# EAGLE design DisplayArrayPlus (EAGLE 9.6.2)

## Sheet 1 of 2
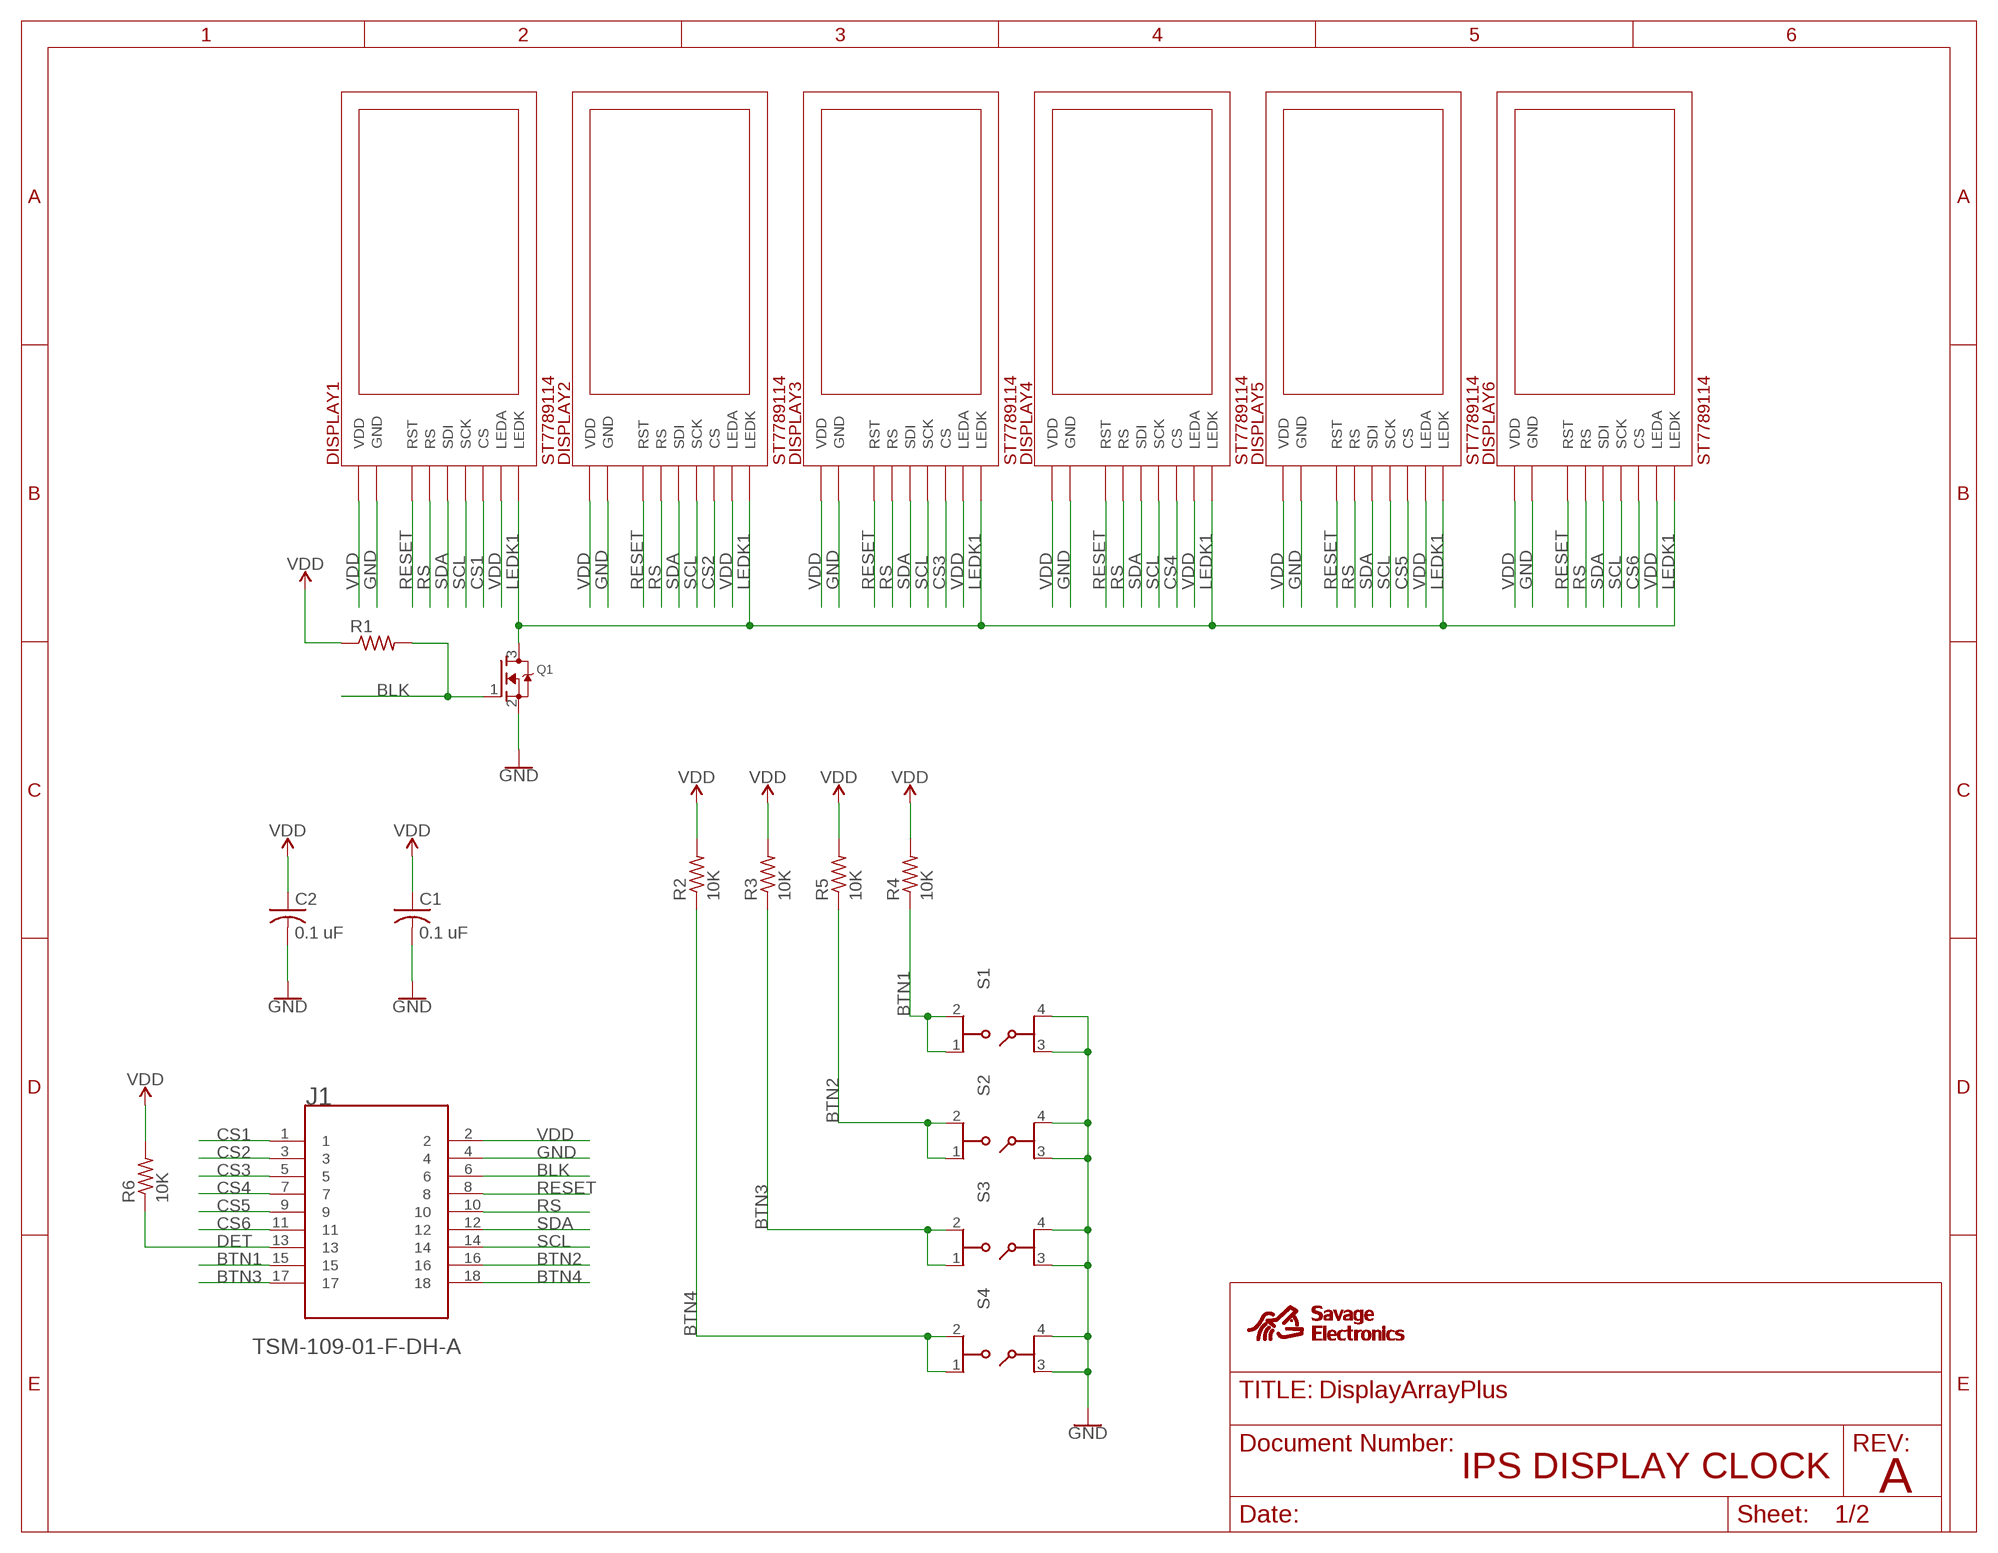
[diagram p0: schematic, sheet 1]

### Parts
C1  0.1 uF  C-USC0603  [C0603]
C2  0.1 uF  C-USC0603  [C0603]
DISPLAY1  ST7789114  [IPSLCD114]
DISPLAY2  ST7789114  [IPSLCD114]
DISPLAY3  ST7789114  [IPSLCD114]
DISPLAY4  ST7789114  [IPSLCD114]
DISPLAY5  ST7789114  [IPSLCD114]
DISPLAY6  ST7789114  [IPSLCD114]
J1  TSM-109-01-F-DH-A  SAMTEC-TSM-109-02-X-DH-AJ  [SAMTEC-TSM-109-02-X-DH-A]
Q1  MOSFET-NREFLOW  [SOT23]
R1  R-US_R0805  [R0805]
R2  10K  R-US_R0805  [R0805]
R3  10K  R-US_R0805  [R0805]
R4  10K  R-US_R0805  [R0805]
R5  10K  R-US_R0805  [R0805]
R6  10K  R-US_R0805  [R0805]
S1  434123025826  [434123025826]
S2  434123025826  [434123025826]
S3  434123025826  [434123025826]
S4  434123025826  [434123025826]
U$3  SE_SMALL_SILK  [SE_SMALL_SILK]

### Nets
BLK: J1.6 Q1.1(G) R1.2
BTN1: J1.15 R4.1 S1.1 S1.2
BTN2: J1.16 R5.1 S2.1 S2.2
BTN3: J1.17 R3.1 S3.1 S3.2
BTN4: J1.18 R2.1 S4.1 S4.2
CS1: DISPLAY1.7(CS) J1.1
CS2: DISPLAY2.7(CS) J1.3
CS3: DISPLAY3.7(CS) J1.5
CS4: DISPLAY4.7(CS) J1.7
CS5: DISPLAY5.7(CS) J1.9
CS6: DISPLAY6.7(CS) J1.11
DET: J1.13 R6.1
GND: C1.2 C2.2 DISPLAY1.8(GND) DISPLAY1.13(GND) DISPLAY2.8(GND) DISPLAY2.13(GND) DISPLAY3.8(GND) DISPLAY3.13(GND) DISPLAY4.8(GND) DISPLAY4.13(GND) DISPLAY5.8(GND) DISPLAY5.13(GND) DISPLAY6.8(GND) DISPLAY6.13(GND) J1.4 Q1.2(S) S1.3 S1.4 S2.3 S2.4 S3.3 S3.4 S4.3 S4.4
LEDK1: DISPLAY1.11(LEDK) DISPLAY2.11(LEDK) DISPLAY3.11(LEDK) DISPLAY4.11(LEDK) DISPLAY5.11(LEDK) DISPLAY6.11(LEDK) Q1.3(D)
RESET: DISPLAY1.6(RST) DISPLAY2.6(RST) DISPLAY3.6(RST) DISPLAY4.6(RST) DISPLAY5.6(RST) DISPLAY6.6(RST) J1.8
RS: DISPLAY1.5(RS) DISPLAY2.5(RS) DISPLAY3.5(RS) DISPLAY4.5(RS) DISPLAY5.5(RS) DISPLAY6.5(RS) J1.10
SCL: DISPLAY1.4(SCK) DISPLAY2.4(SCK) DISPLAY3.4(SCK) DISPLAY4.4(SCK) DISPLAY5.4(SCK) DISPLAY6.4(SCK) J1.14
SDA: DISPLAY1.3(SDI) DISPLAY2.3(SDI) DISPLAY3.3(SDI) DISPLAY4.3(SDI) DISPLAY5.3(SDI) DISPLAY6.3(SDI) J1.12
VDD: C1.1 C2.1 DISPLAY1.10(VDD) DISPLAY1.12(LEDA) DISPLAY2.10(VDD) DISPLAY2.12(LEDA) DISPLAY3.10(VDD) DISPLAY3.12(LEDA) DISPLAY4.10(VDD) DISPLAY4.12(LEDA) DISPLAY5.10(VDD) DISPLAY5.12(LEDA) DISPLAY6.10(VDD) DISPLAY6.12(LEDA) J1.2 R1.1 R2.2 R3.2 R4.2 R5.2 R6.2

### Notes on the sheet
- IPS DISPLAY CLOCK
- A

## Sheet 2 of 2

## Library data of the parts
C1 C2 = Adafruit:C-US: CAPACITOR, American symbol
DISPLAY1-DISPLAY6 = IPSLCD:ST7789114
J1 = TSM-109-02-X-DH-A:SAMTEC-TSM-109-02-X-DH-A
Q1 = Adafruit:MOSFET-N: N-Channel Mosfet 2N7002E - 60V 260mA SOT23 [Digikey: 2N7002ET1GOSTR-ND] - REEL BSH103 - 30V 850mA SOT23 [Digikey: 568-5013-1-ND]
R1-R6 = Adafruit:R-US_: RESISTOR, American symbol
S1-S4 = Eagle_SWITCHES (rev18c):434123025826: 4.2 x 3.2 mm J-Bend SMD Tact Switch WS-TASV MATERIAL PROPERTIES: Cover Material Stainless Steel Actuator Material LCP Actuator Flammability Rating UL94 V-0 Actuator Color White;​ Black Frame Material LCP Frame Flammability Rating UL94 V-0 Frame Color Black Contact Material Stainless Steel Contact Plating Silver Terminal Material Copper Alloy Terminal Plating Silver ELECTRICAL PROPERTIES: Rated Current [1] 50 mA Rated Voltage 16 V (DC) Contact Resistance Initial 500 mΩ Contact Resistance After Life Test 1 Ω Insulation Resistance 100 MΩ Withstanding Voltage 250 V (AC) Bounce 10 ms MECHANICAL PROPERTIES: Operation Force 260 g;​ 160 g Life Cycle 50000 Times;​ 100000 Times GENERAL INFORMATION: Operating Temperature -40 °C up to +85 °C Storage Temperature (in original packaging) -40 °C up to +85 °C PACKAGING PROPERTIES: Packaging Tape and Reel Packaging Unit (Qty.) 2900 <http://katalog.we-online.de/media/images/v2/Family_WS-TASV-4341x30258x6_Gruppe.jpg> Details see: http://katalog.we-online.de/em/datasheet/434123025826.pdf 2017(C) Wurth Elektronik
U$3 = SE_NEWLOGO:SE_SMALL_SILK

## Board
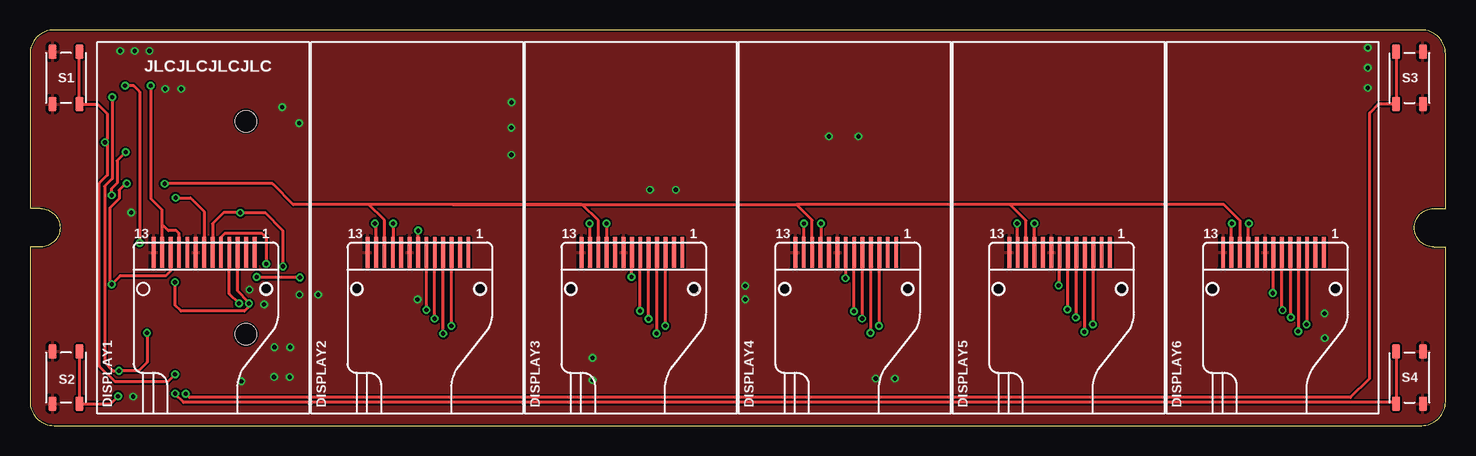
[diagram p1: board, top side]
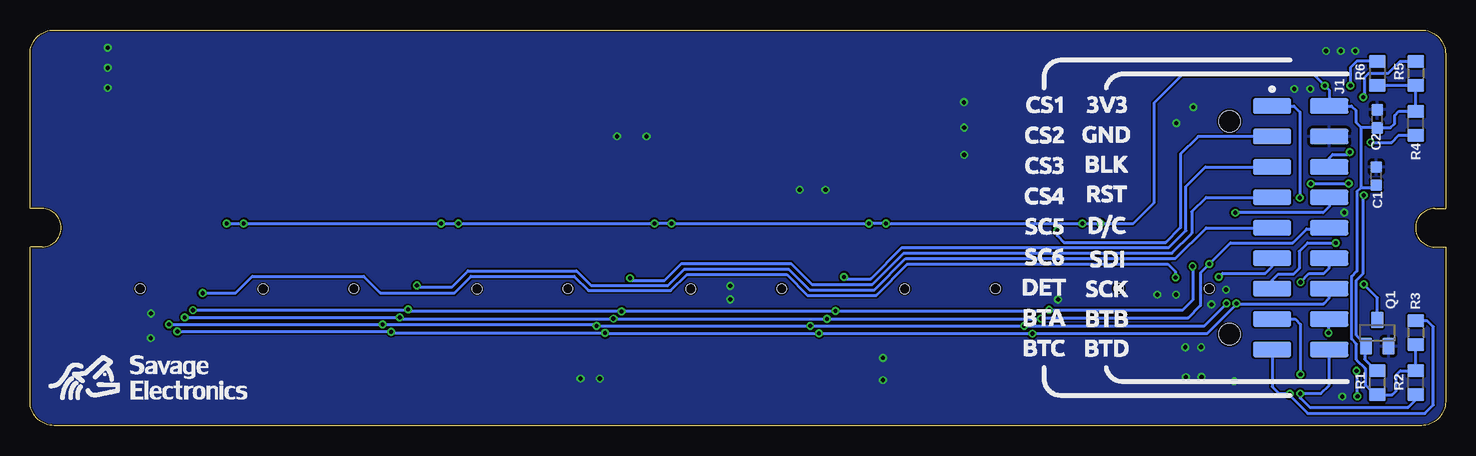
[diagram p2: board, bottom side, seen from below]

Size 118 x 33 mm. Coordinates in mm from the lower left corner, seen from the top.
Outline: 2,0 116,0 arc90 118,2 118,14.9 117,14.9 arc-180 117,18.1 118,18.1 118,31 arc90 116,33 2,33 arc90 0,31 0,18.1 0.9,18.1 arc-180 0.9,14.9 0,14.9 0,2 arc90 2,0
Copper layers (1*16): Top 0.035mm / dielectric 1.5mm / Bottom 0.035mm
Design rules "default *": minimum track width 5mil, minimum drill 0.3mm, track to track 6mil, track to pad 5mil, pad to pad 5mil, via to via 5mil, smd to smd 5mil, copper to edge 6mil, drill to drill 6mil, minimum pad ring 10mil, minimum via ring 6mil, stop-mask expansion 2mil, vias tented up to drill 20mil, thermal gap 10mil
Holes 0.8 mm at 27.25,11.43 45.09,11.4 62.92,11.4 80.72,11.4 98.55,11.4

### Footprints (pad centres in the part's own frame; a part is rotated, then mirrored left to right if it is on the bottom)
C0603 = smd 0.965 x 0.965: 1 -0.748,0; 2 0.748,0
IPSLCD114 = smd 2.6 x 0.4: 1 13.44,4.54; 2 13.44,5.24; 3 13.44,5.94; 4 13.44,6.64; 5 13.44,7.34; 6 13.44,8.04; 7 13.44,8.74; 8 13.44,9.44; 9 13.44,10.14; 10 13.44,10.84; 11 13.44,11.54; 12 13.44,12.24; 13 13.44,12.94 | hole 0.8: 10.424,3.578
SAMTEC-TSM-109-02-X-DH-A = smd 1.27 x 3.18: 1 -10.16,3.543; 2 -10.16,8.306; 3 -7.62,3.543; 4 -7.62,8.306; 5 -5.08,3.543; 6 -5.08,8.306; 7 -2.54,3.543; 8 -2.54,8.306; 9 0,3.543; 10 0,8.306; 11 2.54,3.543; 12 2.54,8.306; 13 5.08,3.543; 14 5.08,8.306; 15 7.62,3.543; 16 7.62,8.306; 17 10.16,3.543; 18 10.16,8.306 | hole 1.78: 8.89,0; -8.89,0
SOT23 = smd 1 x 1.4: 1 -0.95,-1.1; 2 0.95,-1.1; 3 0,1.1
R0805 = smd 1.1 x 1.4: 1 -1,0; 2 1,0
434123025826 = smd 1.168 x 0.711: 1 -2.175,1.121; 2 2.175,1.121; 3 -2.175,-1.121; 4 2.175,-1.121

### Placement (x,y rotation side)
C1  5.77,20.82 90 bottom
C2  5.69,25.59 90 bottom
DISPLAY1  23.26,1 90 top
DISPLAY2  41.09,1 90 top
DISPLAY3  58.92,1 90 top
DISPLAY4  76.74,1 90 top
DISPLAY5  94.57,1 90 top
DISPLAY6  112.4,1 90 top
J1  18,16.5 270 bottom
Q1  5.68,7.72 0 bottom
R1  5.68,3.57 90 bottom
R2  2.47,3.57 90 bottom
R3  2.47,7.75 270 bottom
R4  2.47,25.21 90 bottom
R5  2.47,29.38 270 bottom
R6  5.69,29.38 270 bottom
S1  3,29 270 top
S2  3,4 270 top
S3  115,29 90 top
S4  115,4 90 top
U$3  108,4 0 bottom

### Tracks (layer width: path | path; a pad name or v marks a point on that pad's centre or on a via)
BLK  (via drill 0.35)
  Top 0.254: v7.98,22.81 7.26,22.1 7.26,20.22 6.8,19.76 v6.8,19.2
  Bottom 0.254: R1.2 5.79,4.57 6.75,5.53 6.75,6.5 Q1.1 6.58,6.7 7.42,7.54 7.42,12.12 6.91,12.63 6.91,19.1 v6.8,19.2 | J1.6 9.69,22.31 9.4,22.61 8.18,22.61 v7.98,22.81
BTN1  (via drill 0.35)
  Top 0.254: v12.09,4.27 11.48,3.66 7.09,3.66 5.79,4.95 5.79,20.22 6.45,20.88 6.45,23.42 v6.25,23.62 6.25,23.73 6.45,23.93 6.45,26.01 5.64,26.82 S1.2 S1.1
  Bottom 0.254: v6.25,23.62 4.5,23.62 3.91,24.21 R4.1 | R4.1 | J1.15 12.53,8.88 12.09,8.44 v12.09,4.27
BTN2  (via drill 0.35)
  Top 0.254: v6.86,27.4 6.86,20.6 6.22,19.96 6.22,5.26 6.91,4.57 v7.42,4.57 9.04,4.57 9.75,5.28 v9.75,7.72 | S2.1 S2.2 6.73,1.82 v7.34,2.44
  Bottom 0.254: v6.86,27.4 6.76,27.5 6.76,29.03 6.4,29.38 4.78,29.38 3.78,30.38 R5.1 | v7.34,2.44 7.34,4.5 v7.42,4.57 | J1.16 9.75,8.82 v9.75,7.72
BTN3  (via drill 0.35)
  Top 0.254: S3.2 S3.1 112.41,26.82 111.67,26.08 111.67,3.93 110.08,2.34 13.28,2.34 v12.98,2.64
  Bottom 0.254: J1.17 14.46,3.23 13.87,2.64 v12.98,2.64 12.98,2.52 11.48,1.02 1.73,1.02 1.02,1.73 1.02,8.23 1.53,8.75 R3.1
BTN4  (via drill 0.35)
  Top 0.254: S4.2 S4.1 113.78,1.93 12.8,1.93 12.12,2.62 v12.12,2.67
  Bottom 0.254: J1.18 9.69,3.36 10.39,2.67 v12.12,2.67 12.12,2.31 11.33,1.52 3.12,1.52 2.47,2.17 R2.1
CS1  (via drill 0.35)
  Top 0.254: v12.14,19 13.39,19 14.52,17.87 DISPLAY1.7
  Bottom 0.254: J1.1 12.64,26.66 12.14,26.16 v12.14,19
CS2  (via drill 0.35)
  Top 0.254: DISPLAY2.7 32.35,16.24 v32.36,16.26
  Bottom 0.254: v32.36,16.26 32.36,15.85 31.8,15.29 23.32,15.29 22.1,16.51 22.1,22.64 20.62,24.12 J1.3
CS3  (via drill 0.35)
  Top 0.254: v50.14,12.39 50.14,14.4 DISPLAY3.7
  Bottom 0.254: J1.5 20.01,21.58 21.64,19.95 21.64,16.26 23.06,14.83 45.31,14.83 47.9,12.24 49.99,12.24 v50.14,12.39
CS4  (via drill 0.35)
  Top 0.254: v67.97,12.29 68,12.33 DISPLAY4.7
  Bottom 0.254: v67.97,12.29 67.79,12.12 65.1,12.12 63.7,13.51 54.56,13.51 52.83,11.79 47.75,11.79 45.16,14.38 22.81,14.38 21.16,16.03 21.16,17.84 19.96,19.04 J1.7
CS5  (via drill 0.35)
  Top 0.254: v85.75,11.68 85.83,11.77 DISPLAY5.7
  Bottom 0.254: J1.9 19.94,16.5 22.52,13.92 45.01,13.92 47.6,11.33 53.03,11.33 54.76,13.06 63.45,13.06 64.82,11.68 71.22,11.68 72.44,12.9 81.48,12.9 82.8,11.58 85.65,11.58 v85.75,11.68
CS6  (via drill 0.35)
  Top 0.254: v22.5,12.34 18.95,12.34 v18.9,12.39 | v103.61,11.05 103.66,11.1 DISPLAY6.7
  Bottom 0.254: v18.9,12.39 18.59,12.7 15.03,12.7 14.46,13.27 J1.11 | v103.61,11.05 100.86,11.05 99.47,12.45 90.17,12.45 88.8,11.07 82.6,11.07 81.23,12.45 72.64,12.45 71.45,11.25 64.59,11.25 63.25,12.6 54.91,12.6 53.19,10.87 47.45,10.87 44.86,13.46 23.16,13.46 22.5,12.8 v22.5,12.34
DET  (via drill 0.35)
  Top 0.254: v7.92,28.35 8.64,28.35 9.14,27.84 v9.14,15.24
  Bottom 0.254: R6.1 7.42,30.38 7.92,29.87 v7.92,28.35 | v9.14,15.24 11.48,15.24 12.19,14.53 12.19,13.11 12.66,12.64 13.95,12.64 14.46,12.13 J1.13
GND  (via drill 0.35)
  other vias: 7.52,31.24 8.74,31.24 9.96,31.24 22.45,25.24 21.02,26.56 40.16,26.96 51.67,19.66 53.84,19.66 66.6,24.12 69.06,24.12 111.52,31.52 70.5,3.92 72.11,3.92 21.65,4.04 20.34,4.05 17.63,3.69 46.89,3.79 46.89,5.66 107.93,7.3 107.92,9.36 40.13,24.84 40.13,22.58 59.63,11.64 59.63,10.52 32.3,10.52 22.45,10.92 8.61,2.42 21.69,6.53 20.37,6.53 111.52,29.84 111.52,28.16 24.03,10.92 18.29,11.33 19.51,10.11 12.59,28.08 11.27,28.08 8.43,17.77
  pour Top (rank 2): 2,0 116,0 arc90 118,2 118,31 arc90 116,33 2,33 arc90 0,31 0,2 arc90
  pour Bottom: 2,0 116,0 arc90 118,2 118,31 arc90 116,33 2,33 arc90 0,31 0,2 arc90
LEDK1  (via drill 0.35)
  Top 0.254: v11.23,20.17 20.22,20.17 21.95,18.44 28.25,18.44 | 35.26,18.44 63.91,18.44 | 35.26,18.44 46.03,18.44 47.38,17.09 DISPLAY3.11 | 35.26,18.44 28.25,18.44 | v8.08,20.19 7.98,20.19 7.42,19.63 7.42,18.92 6.66,18.16 6.66,11.94 v6.81,11.79 7.52,12.5 11.33,12.5 11.72,12.89 DISPLAY1.11 | DISPLAY6.11 100.86,17.1 99.52,18.44 81.69,18.44 | DISPLAY4.11 65.2,17.14 63.91,18.44 | DISPLAY2.11 29.55,17.13 28.25,18.44 | 81.69,18.44 63.91,18.44 | 81.69,18.44 83.03,17.09 DISPLAY5.11
  Bottom 0.254: v11.23,20.17 11.2,20.19 v8.08,20.19 | v6.81,11.79 5.68,10.66 Q1.3
RESET  (via drill 0.35)
  Top 0.254: v21.08,13.28 21.08,16.26 19.58,17.75 v17.53,17.75 16.13,17.75 15.22,16.85 DISPLAY1.6 | v104.42,9.63 104.36,9.69 DISPLAY6.6 | v86.49,9.68 86.53,9.72 DISPLAY5.6 | v68.68,9.53 68.7,9.55 DISPLAY4.6 | v50.85,9.55 50.85,14.41 DISPLAY3.6 | v33.05,9.65 DISPLAY2.6
  Bottom 0.254: v104.42,9.63 104.39,9.65 86.46,9.65 v86.49,9.68 86.61,9.55 68.71,9.55 v68.68,9.53 68.66,9.55 v50.85,9.55 33.15,9.55 v33.05,9.65 21.89,9.65 21.08,10.46 v21.08,13.28 | v17.53,17.75 10.19,17.75 9.69,18.25 J1.8
RS  (via drill 0.35)
  Top 0.254: v105.09,9.02 105.09,14.4 DISPLAY6.5 | v87.17,9.02 87.23,9.08 DISPLAY5.5 | v69.37,8.91 69.4,8.95 DISPLAY4.5 | v51.56,8.89 51.56,14.43 DISPLAY3.5 | DISPLAY1.5 15.92,15.72 16.26,16.05 19.3,16.05 19.68,15.68 v19.68,13.48 | v33.73,8.91 33.75,8.93 DISPLAY2.5
  Bottom 0.254: v105.09,9.02 v87.17,9.02 87.07,8.91 v69.37,8.91 51.59,8.91 v51.56,8.89 51.54,8.91 v33.73,8.91 33.66,8.99 21.44,8.99 20.42,10.01 20.42,12.74 v19.68,13.48 17.92,15.24 12.73,15.24 11.58,16.4 9.8,16.4 J1.10
SCL  (via drill 0.35)
  Top 0.254: v105.72,7.85 105.76,7.89 DISPLAY6.4 | v87.88,7.82 87.93,7.87 DISPLAY5.4 | v70.05,7.72 70.1,7.77 DISPLAY4.4 | v52.22,7.7 52.28,7.75 DISPLAY3.4 | v34.44,7.67 v34.45,7.68 DISPLAY2.4 | v17.42,10.19 16.62,10.99 DISPLAY1.4
  Bottom 0.254: J1.14 9.69,10.63 10.16,10.16 17.4,10.16 v17.42,10.19 17.42,10.11 19.86,7.67 v34.44,7.67 52.22,7.67 | v105.72,7.85 87.91,7.85 v87.88,7.82 87.78,7.72 v70.05,7.72 70,7.67 52.22,7.67 | v52.22,7.7 52.22,7.67
SDA  (via drill 0.35)
  Top 0.254: v70.76,8.31 70.8,8.35 DISPLAY4.3 | v52.96,8.31 52.98,8.32 DISPLAY3.3 | DISPLAY1.3 17.32,11.21 18.25,10.28 v18.25,10.18 18.25,9.92 17.88,9.55 12.6,9.55 12.08,10.07 v12.08,11.96 | v35.13,8.31 35.15,8.33 DISPLAY2.3 | v88.59,8.43 88.63,8.47 DISPLAY5.3 | v106.41,8.43 106.46,8.47 DISPLAY6.3
  Bottom 0.254: J1.12 9.69,13.14 10.16,12.68 11.39,12.68 12.08,11.99 v12.08,11.96 | v18.25,10.18 20.12,8.31 v35.13,8.31 v52.96,8.31 v70.76,8.31 70.89,8.43 v88.59,8.43 v88.6,8.43 105.96,8.43 v106.41,8.43
VDD  (via drill 0.35)
  Top 0.254: DISPLAY1.12 11.02,16.76 | 11.02,16.76 11.02,17.98 10.08,18.92 10.08,28.32 v10.06,28.35 | DISPLAY1.10 12.42,16.03 12.19,16.26 11.53,16.26 11.02,16.76 | DISPLAY6.10 101.56,16.83 v101.6,16.87 | DISPLAY5.10 83.73,16.85 v83.72,16.87 | DISPLAY6.12 100.16,16.85 v100.18,16.87 | DISPLAY5.12 82.33,16.83 v82.3,16.87 | v65.94,16.87 65.94,14.47 DISPLAY4.10 | DISPLAY4.12 64.5,16.85 v64.52,16.87 | v48.06,16.87 48.08,16.85 DISPLAY3.10 | DISPLAY3.12 46.68,16.82 v46.63,16.87 | v30.28,16.87 30.28,14.47 DISPLAY2.10 | DISPLAY2.12 28.85,16.77 v28.75,16.87
  Bottom 0.254: 7.04,24.87 7.44,25.27 7.44,26.25 7.85,26.66 J1.2 9.69,27.98 v10.06,28.35 10.97,29.26 21.95,29.26 24.28,26.92 24.28,18.59 26.01,16.87 v28.75,16.87 v30.28,16.87 v46.63,16.87 v48.06,16.87 v64.52,16.87 v65.94,16.87 v82.3,16.87 v83.72,16.87 v100.18,16.87 v101.6,16.87 | R3.2 R2.2 3.76,4.57 4.12,4.22 4.12,2.9 4.44,2.57 R1.1 5.89,2.57 6.7,3.38 6.7,4.77 7.42,5.49 7.42,6.81 7.82,7.21 7.82,12.45 7.39,12.88 7.39,19.51 7.04,19.86 | 7.04,19.86 5.97,19.86 C1.1 | 7.04,19.86 7.04,24.87 | 7.04,24.87 5.72,24.87 C2.1 4.58,24.84 4.24,25.19 4.24,25.86 3.89,26.21 R4.2 R5.2 R6.2

### Text on the board
tPlace: JLCJLCJLCJLC